# Altium project LCDTest2.PrjPcb
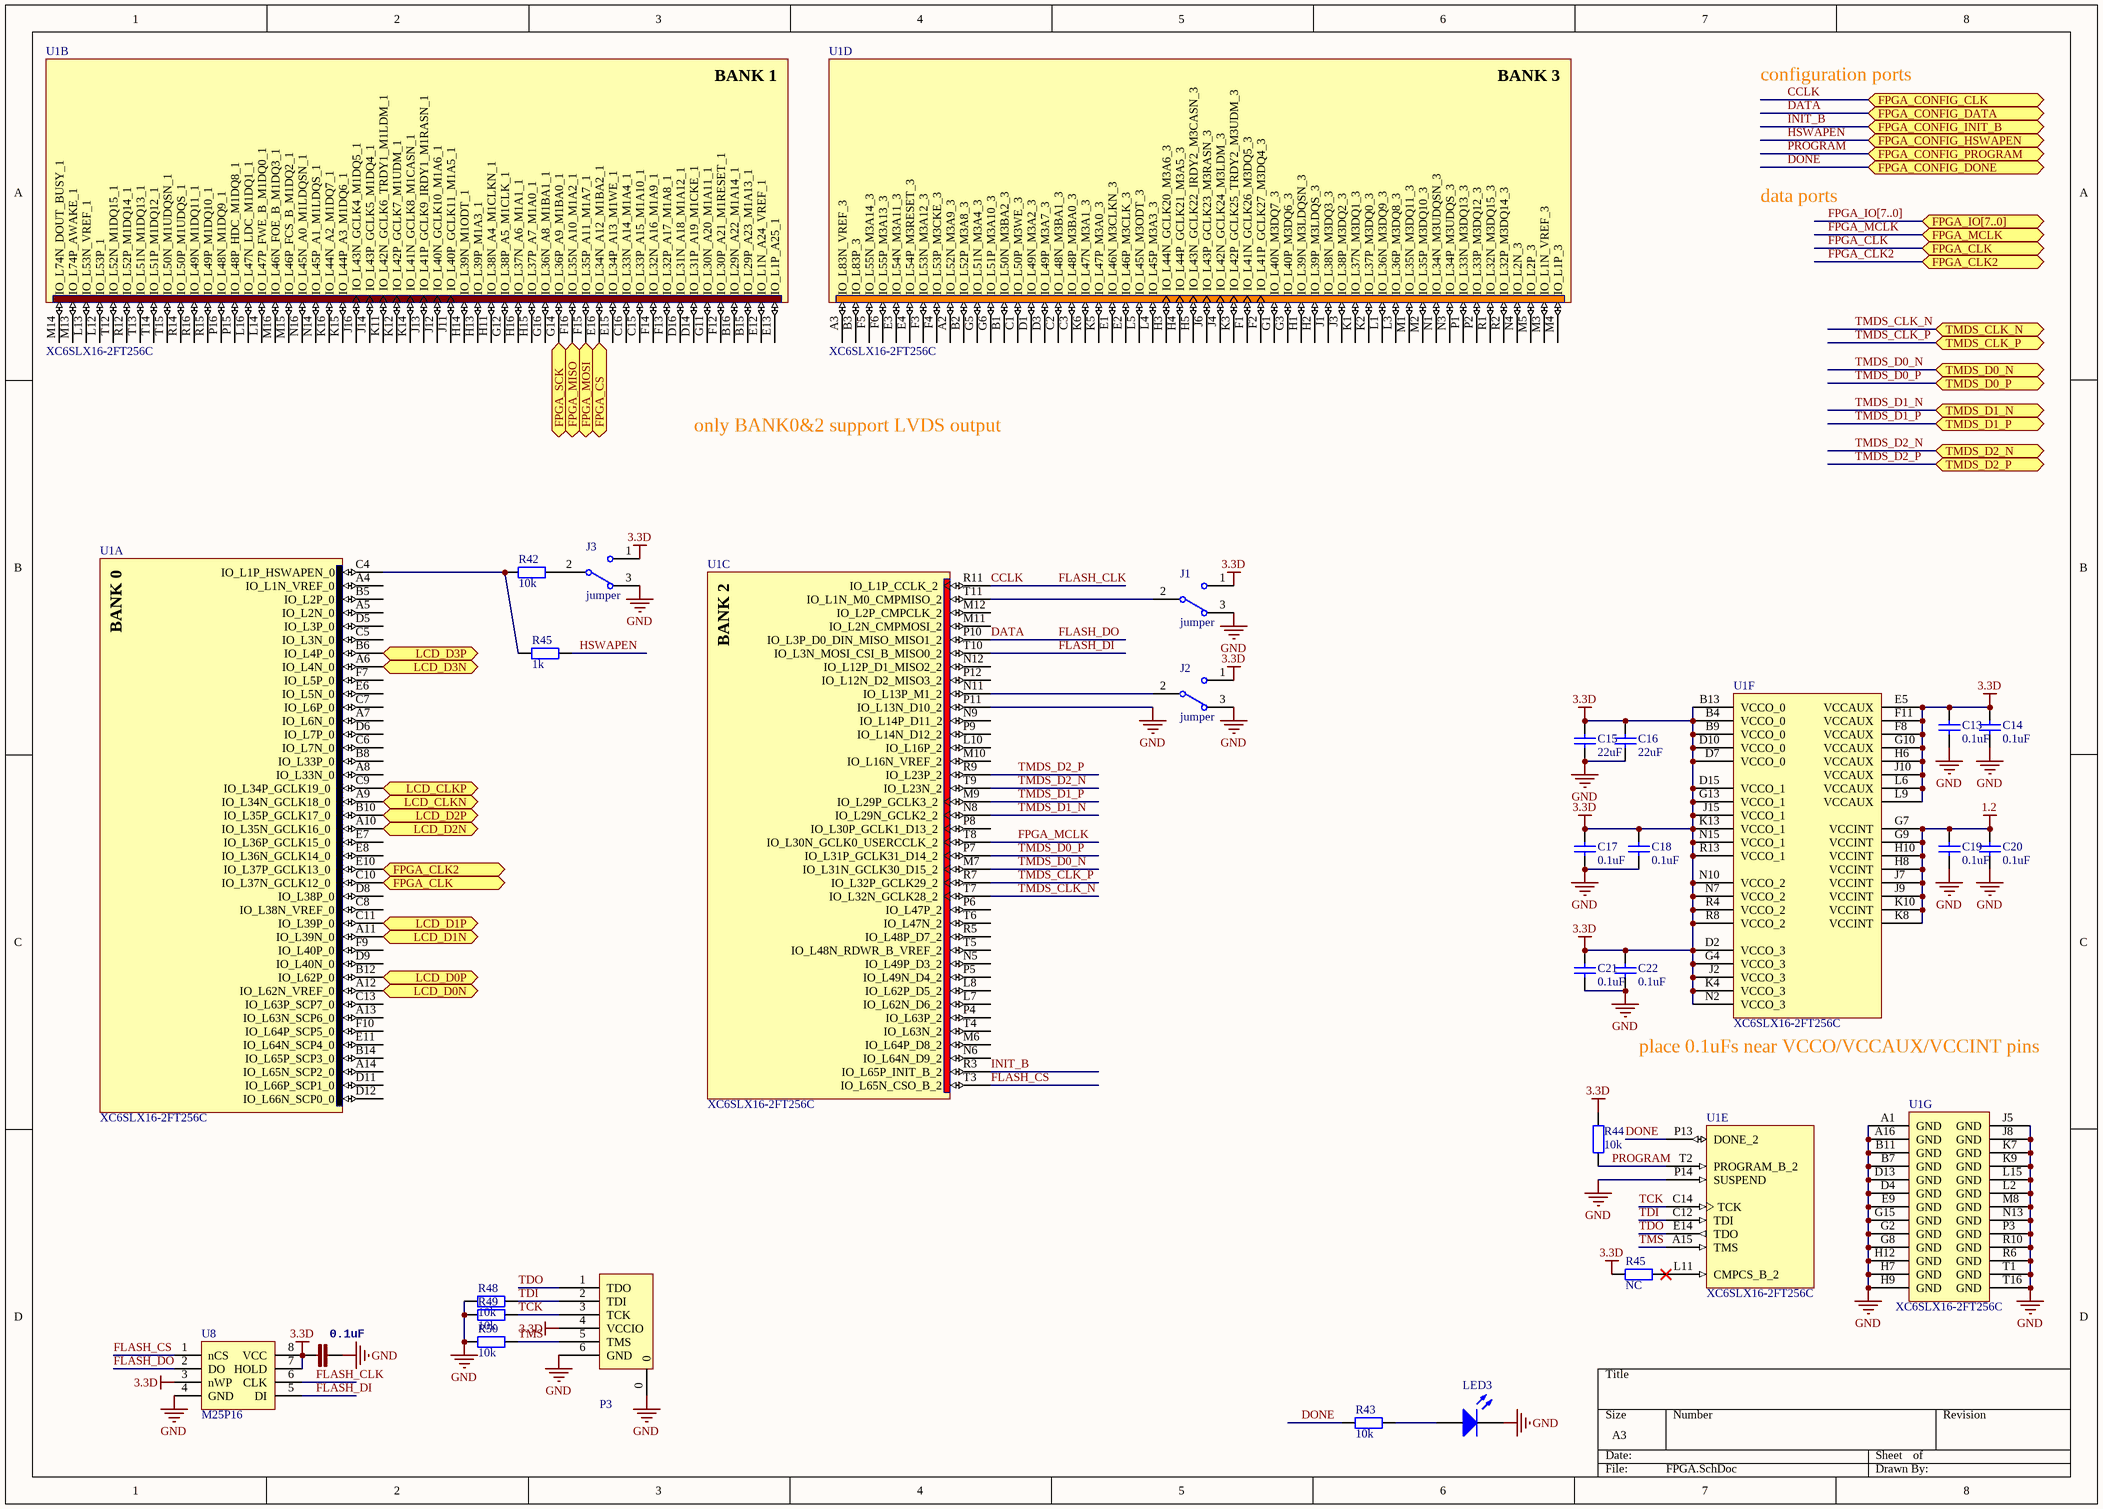
[diagram p0: FPGA.SchDoc]
7 sheets, 154 parts. Net scope: flat (ports and power ports of the same name join across sheets).
Board file: LCDTest2.PcbDoc
Sheets:
  FPGA.SchDoc
  mcu.SchDoc
  camera.SchDoc
  LCD.SchDoc
  USB_HS_PHY.SchDoc
  power.SchDoc
  HDMI.SchDoc

## Sheet FPGA.SchDoc
size A3

### Parts
(Parts that share a designator on the sheet are numbered #1, #2 ... from top to bottom, then left to right.)
C13  0.1uF  [0402]
C14  0.1uF  [0402]
C15  value 22uF  [0805]  (hidden comment: Cap)
C16  value 22uF  [0805]  (hidden comment: Cap)
C17  0.1uF  [0402]
C18  0.1uF  [0402]
C19  0.1uF  [0402]
C20  0.1uF  [0402]
C21  0.1uF  [0402]
C22  0.1uF  [0402]
C68  0.1uF  [0402]
J1  jumper  [0402J]
J2  jumper  [0402J]
J3  jumper  [0402J]
LED3  LED0  [0603]  (value not drawn)
P3  JTAG-6P  [GH1.25-6]  (value not drawn)
R42  10k  [0402]
R43  10k  [0402]
R44  10k  [0402]
R45#1  1k  [0402]
R45#2  NC  [0402]
R48  10k  [0402]
R49  10k  [0402]
R50  10k  [0402]
U1  XC6SLX16-2FT256C  [FT256]  (parts A,B,C,D,E,F,G of 7)
U8  M25P16  [SO8]

### Ports
FPGA_CLK, FPGA_CLK2, FPGA_CONFIG_CLK, FPGA_CONFIG_DATA, FPGA_CONFIG_DONE, FPGA_CONFIG_HSWAPEN, FPGA_CONFIG_INIT_B, FPGA_CONFIG_PROGRAM, FPGA_CS, FPGA_IO[7..0], FPGA_MCLK, FPGA_MISO, FPGA_MOSI, FPGA_SCK, LCD_CLKN, LCD_CLKP, LCD_D0N, LCD_D0P, LCD_D1N, LCD_D1P, LCD_D2N, LCD_D2P, LCD_D3N, LCD_D3P, TMDS_CLK_N, TMDS_CLK_P, TMDS_D0_N, TMDS_D0_P, TMDS_D1_N, TMDS_D1_P, TMDS_D2_N, TMDS_D2_P

### Nets
1.2: C19.1 C20.1 U1.G7(VCCINT) U1.G9(VCCINT) U1.H8(VCCINT) U1.H10(VCCINT) U1.J7(VCCINT) U1.J9(VCCINT) U1.K8(VCCINT) U1.K10(VCCINT)
3.3D: C13.1 C14.1 C15.2 C16.2 C17.1 C18.1 C21.1 C22.1 C68.2 J1.1 J2.1 J3.1 P3.4(VCCIO) R44.1 R45#2.2 U1.B4(VCCO_0) U1.B9(VCCO_0) U1.B13(VCCO_0) U1.D2(VCCO_3) U1.D7(VCCO_0) U1.D10(VCCO_0) U1.D15(VCCO_1) U1.E5(VCCAUX) U1.F8(VCCAUX) U1.F11(VCCAUX) U1.G4(VCCO_3) U1.G10(VCCAUX) U1.G13(VCCO_1) U1.H6(VCCAUX) U1.J2(VCCO_3) U1.J10(VCCAUX) U1.J15(VCCO_1) U1.K4(VCCO_3) U1.K13(VCCO_1) U1.L6(VCCAUX) U1.L9(VCCAUX) U1.N2(VCCO_3) U1.N7(VCCO_2) U1.N10(VCCO_2) U1.N15(VCCO_1) U1.R4(VCCO_2) U1.R8(VCCO_2) U1.R13(VCCO_1) U8.3(nWP) U8.7(HOLD) U8.8(VCC)
GND: C13.2 C14.2 C15.1 C16.1 C17.2 C18.2 C19.2 C20.2 C21.2 C22.2 C68.1 J1.3 J2.3 J3.3 LED3.2(K) P3.0 P3.6(GND) R48.2 R49.2 R50.2 U1.A1(GND) U1.A16(GND) U1.B7(GND) U1.B11(GND) U1.D4(GND) U1.D13(GND) U1.E9(GND) U1.G2(GND) U1.G8(GND) U1.G15(GND) U1.H7(GND) U1.H9(GND) U1.H12(GND) U1.J5(GND) U1.J8(GND) U1.K7(GND) U1.K9(GND) U1.L2(GND) U1.L15(GND) U1.M8(GND) U1.N13(GND) U1.P3(GND) U1.P11(IO_L13N_D10_2) U1.P14(SUSPEND) U1.R6(GND) U1.R10(GND) U1.T1(GND) U1.T16(GND) U8.4(GND)
CCLK: U1.R11(IO_L1P_CCLK_2) U8.6(CLK) ; port FPGA_CONFIG_CLK  [also labelled FLASH_CLK]
CK_N: U1.A9(IO_L34N_GCLK18_0) ; port LCD_CLKN
CK_P: U1.C9(IO_L34P_GCLK19_0) ; port LCD_CLKP
D0_N: U1.A12(IO_L62N_VREF_0) ; port LCD_D0N
D0_P: U1.B12(IO_L62P_0) ; port LCD_D0P
D1_N: U1.A11(IO_L39N_0) ; port LCD_D1N
D1_P: U1.C11(IO_L39P_0) ; port LCD_D1P
D2_N: U1.A10(IO_L35N_GCLK16_0) ; port LCD_D2N
D2_P: U1.B10(IO_L35P_GCLK17_0) ; port LCD_D2P
D3_N: U1.A6(IO_L4N_0) ; port LCD_D3N
D3_P: U1.B6(IO_L4P_0) ; port LCD_D3P
DATA: U1.P10(IO_L3P_D0_DIN_MISO_MISO1_2) U8.2(DO) ; port FPGA_CONFIG_DATA  [also labelled FLASH_DO]
DONE: R43.1 U1.P13(DONE_2) ; port FPGA_CONFIG_DONE
FLASH_CS: U1.T3(IO_L65N_CSO_B_2) U8.1(nCS)
FLASH_DI: U1.T10(IO_L3N_MOSI_CSI_B_MISO0_2) U8.5(DI)
FPGA_CLK: U1.C10(IO_L37N_GCLK12_0) ; port FPGA_CLK
FPGA_CLK2: U1.E10(IO_L37P_GCLK13_0) ; port FPGA_CLK2
FPGA_MCLK: U1.T8(IO_L30N_GCLK0_USERCCLK_2) ; port FPGA_MCLK
HSWAPEN: R45#1.1 ; port FPGA_CONFIG_HSWAPEN
INIT_B: U1.R3(IO_L65P_INIT_B_2) ; port FPGA_CONFIG_INIT_B
PC10: U1.G14(IO_L36P_A9_M1BA0_1) ; port FPGA_SCK
PC11: U1.F16(IO_L35N_A10_M1A2_1) ; port FPGA_MISO
PC12: U1.F15(IO_L35P_A11_M1A7_1) ; port FPGA_MOSI
PROGRAM: R44.2 U1.T2(PROGRAM_B_2) ; port FPGA_CONFIG_PROGRAM
TCK: P3.3(TCK) R49.1 U1.C14(TCK)
TDI: P3.2(TDI) R48.1 U1.C12(TDI)
TDO: P3.1(TDO) U1.E14(TDO)
TMDS_CLK_N: U1.T7(IO_L32N_GCLK28_2) ; port TMDS_CLK_N
TMDS_CLK_P: U1.R7(IO_L32P_GCLK29_2) ; port TMDS_CLK_P
TMDS_D0_N: U1.M7(IO_L31N_GCLK30_D15_2) ; port TMDS_D0_N
TMDS_D0_P: U1.P7(IO_L31P_GCLK31_D14_2) ; port TMDS_D0_P
TMDS_D1_N: U1.N8(IO_L29N_GCLK2_2) ; port TMDS_D1_N
TMDS_D1_P: U1.M9(IO_L29P_GCLK3_2) ; port TMDS_D1_P
TMDS_D2_N: U1.T9(IO_L23N_2) ; port TMDS_D2_N
TMDS_D2_P: U1.R9(IO_L23P_2) ; port TMDS_D2_P
TMS: P3.5(TMS) R50.1 U1.A15(TMS)
NetJ1_2: J1.2 U1.T11(IO_L1N_M0_CMPMISO_2)
NetJ2_2: J2.2 U1.N11(IO_L13P_M1_2)
NetJ3_2: J3.2 R42.1
NetLED3_1: LED3.1(A) R43.2
NetMCU1_2: U1.E16(IO_L34N_A12_M1BA2_1) ; port FPGA_CS
NetR42_2: R42.2 R45#1.2 U1.C4(IO_L1P_HSWAPEN_0)
NetR45#2_1: R45#2.1 U1.L11(CMPCS_B_2)

Not connected (* = marked no-connect by the designer): U1 A2(IO_L52N_M3A9_3) A3(IO_L83N_VREF_3) A4(IO_L1N_VREF_0) A5(IO_L2N_0) A7(IO_L6N_0) A8(IO_L33N_0) A13(IO_L63N_SCP6_0) A14(IO_L65N_SCP2_0) B1(IO_L50N_M3BA2_3) B2(IO_L52P_M3A8_3) B3(IO_L83P_3) B5(IO_L2P_0) B8(IO_L33P_0) B14(IO_L65P_SCP3_0) B15(IO_L29P_A23_M1A13_1) B16(IO_L29N_A22_M1A14_1) C1(IO_L50P_M3WE_3) C2(IO_L48N_M3BA1_3) C3(IO_L48P_M3BA0_3) C5(IO_L3N_0) C6(IO_L7N_0) C7(IO_L6P_0) C8(IO_L38N_VREF_0) C13(IO_L63P_SCP7_0) C15(IO_L33P_A15_M1A10_1) C16(IO_L33N_A14_M1A4_1) D1(IO_L49N_M3A2_3) D3(IO_L49P_M3A7_3) D5(IO_L3P_0) D6(IO_L7P_0) D8(IO_L38P_0) D9(IO_L40N_0) D11(IO_L66P_SCP1_0) D12(IO_L66N_SCP0_0) D14(IO_L31P_A19_M1CKE_1) D16(IO_L31N_A18_M1A12_1) E1(IO_L46N_M3CLKN_3) E2(IO_L46P_M3CLK_3) E3(IO_L54N_M3A11_3) E4(IO_L54P_M3RESET_3) E6(IO_L5N_0) E7(IO_L36P_GCLK15_0) E8(IO_L36N_GCLK14_0) E11(IO_L64N_SCP4_0) E12(IO_L1N_A24_VREF_1) E13(IO_L1P_A25_1) E15(IO_L34P_A13_M1WE_1) F1(IO_L41N_GCLK26_M3DQ5_3) F2(IO_L41P_GCLK27_M3DQ4_3) F3(IO_L53N_M3A12_3) F4(IO_L53P_M3CKE_3) F5(IO_L55N_M3A14_3) F6(IO_L55P_M3A13_3) F7(IO_L5P_0) F9(IO_L40P_0) F10(IO_L64P_SCP5_0) F12(IO_L30P_A21_M1RESET_1) F13(IO_L32P_A17_M1A8_1) F14(IO_L32N_A16_M1A9_1) G1(IO_L40N_M3DQ7_3) G3(IO_L40P_M3DQ6_3) G5(IO_L51N_M3A4_3) G6(IO_L51P_M3A10_3) G11(IO_L30N_A20_M1A11_1) G12(IO_L38P_A5_M1CLK_1) G16(IO_L36N_A8_M1BA1_1) H1(IO_L39N_M3LDQSN_3) H2(IO_L39P_M3LDQS_3) H3(IO_L44N_GCLK20_M3A6_3) H4(IO_L44P_GCLK21_M3A5_3) H5(IO_L43N_GCLK22_IRDY2_M3CASN_3) H11(IO_L38N_A4_M1CLKN_1) H13(IO_L39P_M1A3_1) H14(IO_L39N_M1ODT_1) H15(IO_L37P_A7_M1A0_1) H16(IO_L37N_A6_M1A1_1) J1(IO_L38N_M3DQ3_3) J3(IO_L38P_M3DQ2_3) J4(IO_L42N_GCLK24_M3LDM_3) J6(IO_L43P_GCLK23_M3RASN_3) J11(IO_L40P_GCLK11_M1A5_1) J12(IO_L40N_GCLK10_M1A6_1) J13(IO_L41P_GCLK9_IRDY1_M1RASN_1) J14(IO_L43P_GCLK5_M1DQ4_1) J16(IO_L43N_GCLK4_M1DQ5_1) K1(IO_L37N_M3DQ1_3) K2(IO_L37P_M3DQ0_3) K3(IO_L42P_GCLK25_TRDY2_M3UDM_3) K5(IO_L47P_M3A0_3) K6(IO_L47N_M3A1_3) K11(IO_L42N_GCLK6_TRDY1_M1LDM_1) K12(IO_L42P_GCLK7_M1UDM_1) K14(IO_L41N_GCLK8_M1CASN_1) K15(IO_L44P_A3_M1DQ6_1) K16(IO_L44N_A2_M1DQ7_1) L1(IO_L36N_M3DQ9_3) L3(IO_L36P_M3DQ8_3) L4(IO_L45P_M3A3_3) L5(IO_L45N_M3ODT_3) L7(IO_L62N_D6_2) L8(IO_L62P_D5_2) L10(IO_L16P_2) L12(IO_L53P_1) L13(IO_L53N_VREF_1) L14(IO_L47P_FWE_B_M1DQ0_1) L16(IO_L47N_LDC_M1DQ1_1) M1(IO_L35N_M3DQ11_3) M2(IO_L35P_M3DQ10_3) M3(IO_L1N_VREF_3) M4(IO_L1P_3) M5(IO_L2P_3) M6(IO_L64P_D8_2) M10(IO_L16N_VREF_2) M11(IO_L2N_CMPMOSI_2) M12(IO_L2P_CMPCLK_2) M13(IO_L74P_AWAKE_1) M14(IO_L74N_DOUT_BUSY_1) M15(IO_L46P_FCS_B_M1DQ2_1) M16(IO_L46N_FOE_B_M1DQ3_1) N1(IO_L34N_M3UDQSN_3) N3(IO_L34P_M3UDQS_3) N4(IO_L2N_3) N5(IO_L49P_D3_2) N6(IO_L64N_D9_2) N9(IO_L14P_D11_2) N12(IO_L12P_D1_MISO2_2) N14(IO_L45P_A1_M1LDQS_1) N16(IO_L45N_A0_M1LDQSN_1) P1(IO_L33N_M3DQ13_3) P2(IO_L33P_M3DQ12_3) P4(IO_L63P_2) P5(IO_L49N_D4_2) P6(IO_L47P_2) P8(IO_L30P_GCLK1_D13_2) P9(IO_L14N_D12_2) P12(IO_L12N_D2_MISO3_2) P15(IO_L48P_HDC_M1DQ8_1) P16(IO_L48N_M1DQ9_1) R1(IO_L32N_M3DQ15_3) R2(IO_L32P_M3DQ14_3) R5(IO_L48P_D7_2) R12(IO_L52P_M1DQ14_1) R14(IO_L50P_M1UDQS_1) R15(IO_L49P_M1DQ10_1) R16(IO_L49N_M1DQ11_1) T4(IO_L63N_2) T5(IO_L48N_RDWR_B_VREF_2) T6(IO_L47N_2) T12(IO_L52N_M1DQ15_1) T13(IO_L51N_M1DQ13_1) T14(IO_L51P_M1DQ12_1) T15(IO_L50N_M1UDQSN_1)

### Buses and harness runs
bus FPGA_IO[7..0] = port FPGA_IO[7..0]

### Notes on the sheet
- configuration ports
- data ports
- only BANK0&2 support LVDS output
- (near U1) place 0.1uFs near VCCO/VCCAUX/VCCINT pins
- (in symbol XC6SLX16-2FT256C, part A) BANK 0
- (in symbol XC6SLX16-2FT256C, part B) BANK 1
- (in symbol XC6SLX16-2FT256C, part C) BANK 2
- (in symbol XC6SLX16-2FT256C, part D) BANK 3

### Library data of the parts
C13-C22 = Cap: Capacitor; Published: 8-Jun-2000; LatestRevisionDate: 17-Jul-2002; LatestRevisionNote: Re-released for DXP Platform.; PackageReference: RAD-0.3; Publisher: Altium Limited; PackageDescription: Radial Cap, Thru-Hole; 2 Leads; 0.3 in Pin Spacing
C68 = CAP0402-CAP: <b>Capacitor</b> / Standard 0603 ceramic capacitor, and 0.1" leaded capacitor.; PARTNO: CC0402ZRY5V7BB104
J1-J3 = SW-SPDT: SPDT Subminiature Toggle Switch, Right Angle Mounting, Vertical Actuation; Published: 24-Mar-1999; LatestRevisionDate: 17-Dec-2003; LatestRevisionNote: Schematic revised, PCB Footprint replaced.; DatasheetVersion: 05-Dec-2000; PackageReference: TL36WW15050; Publisher: Altium Limited; PackageDescription: Switch; 4 Leads; ComponentLink1Description: Manufacturer Link; ComponentLink1URL: http://www.apem.com
LED3 = LED0: Typical INFRARED GaAs LED; Published: 8-Jun-2000; LatestRevisionDate: 08-Jul-2005; LatestRevisionNote: Mech Layer 1 removed.; PackageReference: LED-0; Publisher: Altium Limited; PackageDescription: LED; 2 Leads
R42-R44 R45#1 R45#2 R48-R50 = Res2: Resistor; Published: 8-Jun-2000; LatestRevisionDate: 17-Jul-2002; LatestRevisionNote: Re-released for DXP Platform.; PackageReference: AXIAL-0.4; Publisher: Altium Limited; PackageDescription: Axial Device, Thru-Hole; 2 Leads; 0.4 in Pin Spacing
U1 = XC6SLX16-2FT256C: Spartan-6 LX 1.2V FPGA, 186 User I/Os, 256-Ball Fine-Pitch Thin BGA (1.0mm Pitch), Speed Grade 2, Commercial Grade; Published: 17-Nov-2009; DatasheetVersion: ver1.6, Nov-2010; PackageVersion: ver1.3, Oct-2007; PackageReference: FT256; Publisher: Altium Limited; PackageDescription: 256-Ball Fine Pitch Thin Ball Grid Array 1.00 mm Pitch (FT256); Code_JEDEC: MS-034-AAF-1*; ComponentLink1Description: Manufacturer Link; ComponentLink1URL: http://www.xilinx.com; ComponentLink2Description: Spartan-6 Datasheet; ComponentLink2URL: http://www.xilinx.com/support/documentation/data_sheets/ds160.pdf; ComponentLink3Description: Spartan-6 Documents; ComponentLink3URL: http://www.xilinx.com/support/documentation/spartan-6.htm; ComponentLink4Description: Xilinx.com Home; ComponentLink4URL: http://www.xilinx.com

## Sheet mcu.SchDoc
size A4
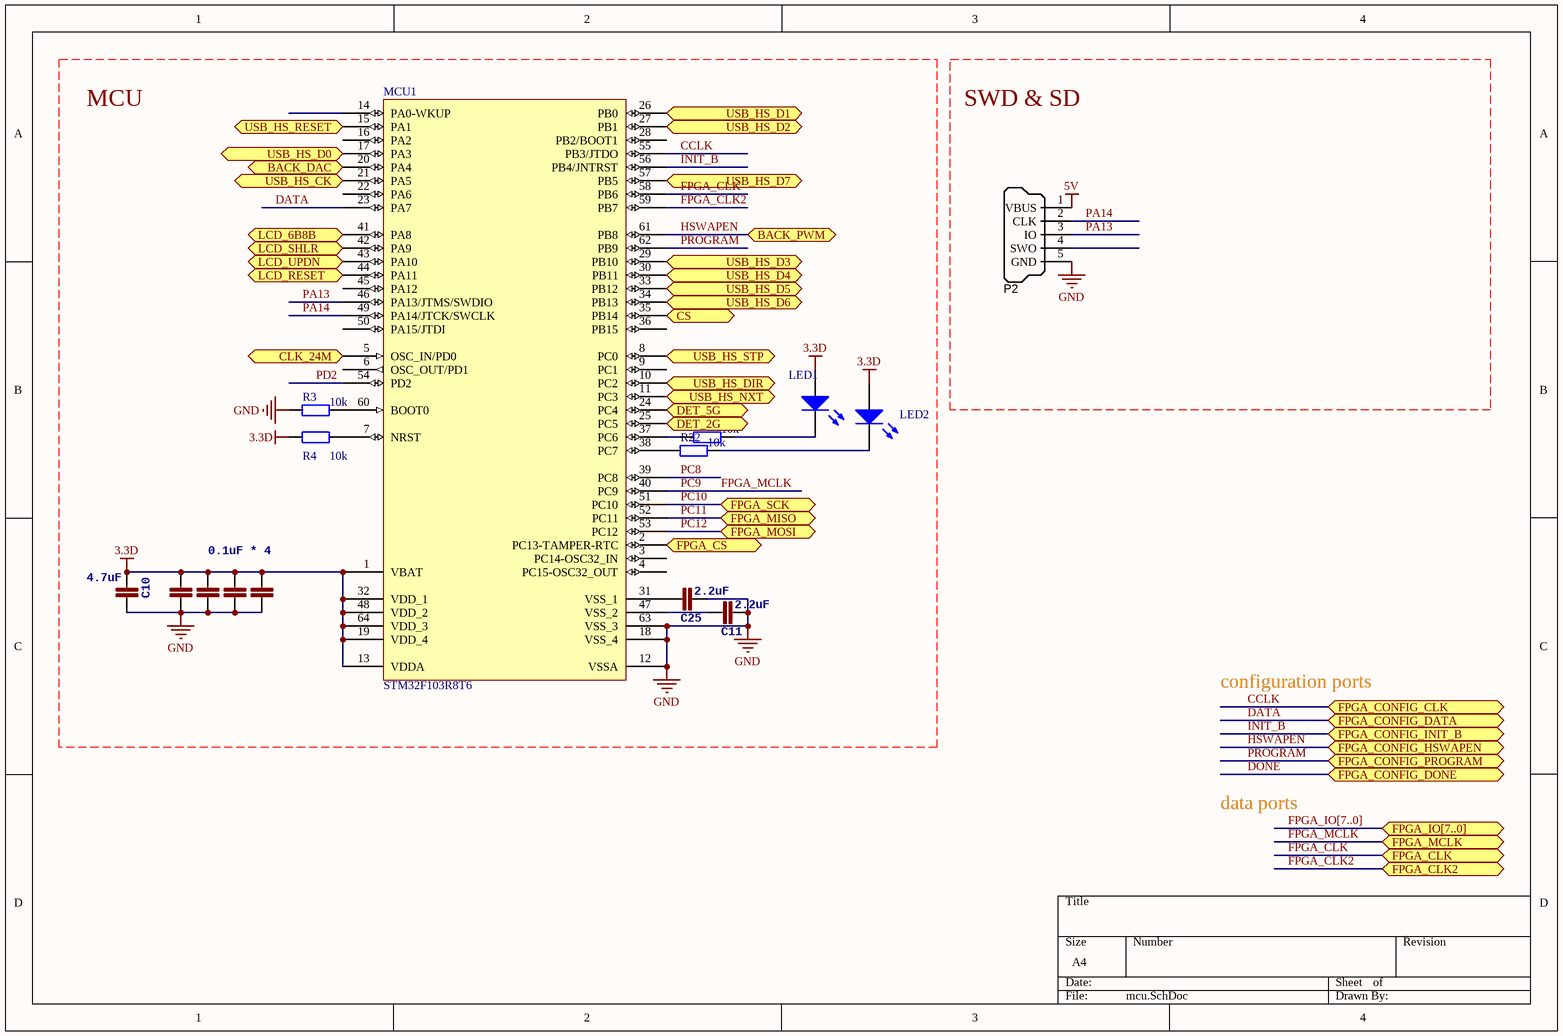
[diagram p1: mcu.SchDoc]

### Parts
C4  0.1uF * 4  [0402]
C5  1n  [0402]  (value not drawn)
C6  1n  [0402]  (value not drawn)
C7  1n  [0402]  (value not drawn)
C10  4.7uF  [0603]
C11  2.2uF  [0603]
C25  2.2uF  [0603]
LED1  LED0  [0603]  (value not drawn)
LED2  LED0  [0603]  (value not drawn)
MCU1  STM32F103R8T6  [LQFP64_N]
P2  SWD_MicroUSB  [MICRO-YZX]  (value not drawn)
R3  10k  [0402]
R4  10k  [0402]
R21  10k  [0402]
R22  10k  [0402]

### Ports
BACK_DAC, BACK_PWM, CLK_24M, CS, DET_2G, DET_5G, FPGA_CLK, FPGA_CLK2, FPGA_CONFIG_CLK, FPGA_CONFIG_DATA, FPGA_CONFIG_DONE, FPGA_CONFIG_HSWAPEN, FPGA_CONFIG_INIT_B, FPGA_CONFIG_PROGRAM, FPGA_CS, FPGA_IO[7..0], FPGA_MCLK, FPGA_MISO, FPGA_MOSI, FPGA_SCK, LCD_6B8B, LCD_RESET, LCD_SHLR, LCD_UPDN, USB_HS_CK, USB_HS_D0, USB_HS_D1, USB_HS_D2, USB_HS_D3, USB_HS_D4, USB_HS_D5, USB_HS_D6, USB_HS_D7, USB_HS_DIR, USB_HS_NXT, USB_HS_RESET, USB_HS_STP

### Nets
3.3D: C4.2 C5.2 C6.2 C7.2 C10.2 LED1.1(A) LED2.1(A) MCU1.1(VBAT) MCU1.13(VDDA) MCU1.19(VDD_4) MCU1.32(VDD_1) MCU1.48(VDD_2) MCU1.64(VDD_3) R4.2
5V: P2.1(VBUS)
GND: C4.1 C5.1 C6.1 C7.1 C10.1 C11.2 C25.2 MCU1.12(VSSA) MCU1.18(VSS_4) MCU1.63(VSS_3) P2.5(GND) R3.1
CCLK: MCU1.55(PB3/JTDO) ; port FPGA_CONFIG_CLK
DATA: MCU1.23(PA7) ; port FPGA_CONFIG_DATA
FPGA_CLK: MCU1.58(PB6) ; port FPGA_CLK
FPGA_CLK2: MCU1.59(PB7) ; port FPGA_CLK2
FPGA_MCLK: MCU1.40(PC9) ; port FPGA_MCLK  [also labelled PC9]
HSWAPEN: MCU1.61(PB8) ; port FPGA_CONFIG_HSWAPEN, port BACK_PWM
INIT_B: MCU1.56(PB4/JNTRST) ; port FPGA_CONFIG_INIT_B
PA13: MCU1.46(PA13/JTMS/SWDIO) P2.3(IO)
PA14: MCU1.49(PA14/JTCK/SWCLK) P2.2(CLK)
PC8: MCU1.39(PC8)
PC10: MCU1.51(PC10) ; port FPGA_SCK
PC11: MCU1.52(PC11) ; port FPGA_MISO
PC12: MCU1.53(PC12) ; port FPGA_MOSI
PD2: MCU1.54(PD2)
PROGRAM: MCU1.62(PB9) ; port FPGA_CONFIG_PROGRAM
USB_HS_CK: MCU1.21(PA5) ; port USB_HS_CK
USB_HS_DIR: MCU1.10(PC2) ; port USB_HS_DIR
USB_HS_NXT: MCU1.11(PC3) ; port USB_HS_NXT
USB_HS_RESET: MCU1.15(PA1) ; port USB_HS_RESET
USB_HS_STP: MCU1.8(PC0) ; port USB_HS_STP
NetC11_1: C11.1 MCU1.47(VSS_2)
NetC25_1: C25.1 MCU1.31(VSS_1)
NetC108_2: MCU1.5(OSC_IN/PD0) ; port CLK_24M
NetLED1_2: LED1.2(K) R21.2
NetLED2_2: LED2.2(K) R22.2
NetMCU1_2: MCU1.2(PC13-TAMPER-RTC) ; port FPGA_CS
NetMCU1_7: MCU1.7(NRST) R4.1
NetMCU1_17: MCU1.17(PA3) ; port USB_HS_D0
NetMCU1_20: MCU1.20(PA4) ; port BACK_DAC
NetMCU1_24: MCU1.24(PC4) ; port DET_5G
NetMCU1_25: MCU1.25(PC5) ; port DET_2G
NetMCU1_26: MCU1.26(PB0) ; port USB_HS_D1
NetMCU1_27: MCU1.27(PB1) ; port USB_HS_D2
NetMCU1_29: MCU1.29(PB10) ; port USB_HS_D3
NetMCU1_30: MCU1.30(PB11) ; port USB_HS_D4
NetMCU1_33: MCU1.33(PB12) ; port USB_HS_D5
NetMCU1_34: MCU1.34(PB13) ; port USB_HS_D6
NetMCU1_35: MCU1.35(PB14) ; port CS
NetMCU1_37: MCU1.37(PC6) R21.1
NetMCU1_38: MCU1.38(PC7) R22.1
NetMCU1_41: MCU1.41(PA8) ; port LCD_6B8B
NetMCU1_42: MCU1.42(PA9) ; port LCD_SHLR
NetMCU1_43: MCU1.43(PA10) ; port LCD_UPDN
NetMCU1_44: MCU1.44(PA11) ; port LCD_RESET
NetMCU1_57: MCU1.57(PB5) ; port USB_HS_D7
NetMCU1_60: MCU1.60(BOOT0) R3.2

Not connected (* = marked no-connect by the designer): MCU1 3(PC14-OSC32_IN) 4(PC15-OSC32_OUT) 6(OSC_OUT/PD1) 9(PC1) 14(PA0-WKUP) 16(PA2) 22(PA6) 28(PB2/BOOT1) 36(PB15) 45(PA12) 50(PA15/JTDI); P2 4(SWO)

### Buses and harness runs
bus FPGA_IO[7..0] = port FPGA_IO[7..0]

### Notes on the sheet
- MCU
- SWD & SD
- configuration ports
- data ports

### Library data of the parts
C4-C7 C10 C11 C25 = CAP0402-CAP: as C68 on sheet FPGA
LED1 LED2 = LED0: Typical INFRARED GaAs LED; Published: 8-Jun-2000; LatestRevisionDate: 08-Jul-2005; LatestRevisionNote: Mech Layer 1 removed.; PackageReference: LED-0; Publisher: Altium Limited; PackageDescription: LED; 2 Leads
MCU1 = STM32F103R8T6: STM32 ARM-based 32-bit MCU with 64 Kbytes Flash, 64-pin LQFP, Industrial Temperature; Published: *; DatasheetVersion: *; PackageVersion: *; PackageReference: *; Publisher: *; PackageDescription: *; ComponentLink1Description: *; ComponentLink1URL: *; ComponentLink2Description: *; ComponentLink2URL: *
P2 = SWD_MicroUSB: Connector SMD USB Micro Type B middle mount; Manufacturer 1: Molex Inc; SCDType: undef; Package / Case: SMD; Supplier 1: Digi-Key; Supplier Part Number 1: WM17142CT-ND
R3 R4 R21 R22 = Res2: Resistor; Value: 0Ohm; Published: 8-Jun-2000; LatestRevisionDate: 17-Jul-2002; LatestRevisionNote: Re-released for DXP Platform.; PackageReference: AXIAL-0.4; Publisher: Altium Limited; PackageDescription: Axial Device, Thru-Hole; 2 Leads; 0.4 in Pin Spacing

## Sheet camera.SchDoc
size A4
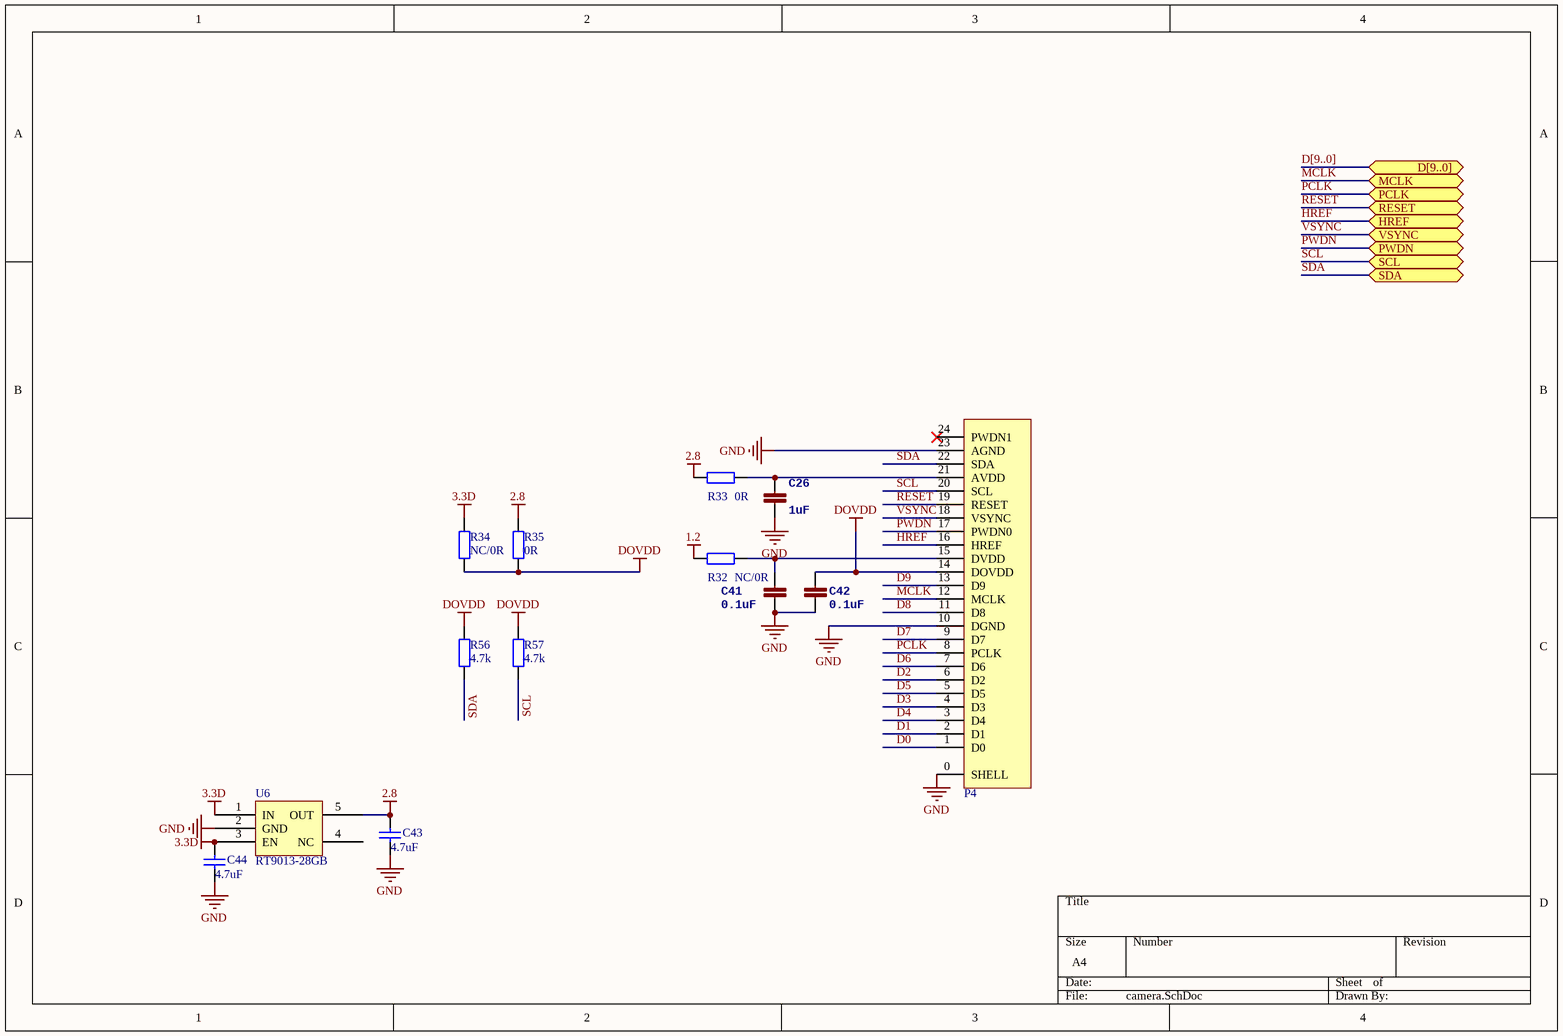
[diagram p2: camera.SchDoc]

### Parts
C26  1uF  [0402]
C41  0.1uF  [0402]
C42  0.1uF  [0402]
C43  4.7uF  [0603]
C44  4.7uF  [0603]
P4  Camera24P-2  [FPC-0.5mm-24]  (value not drawn)
R32  NC/0R  [0402]
R33  0R  [0402]
R34  NC/0R  [0402]
R35  0R  [0402]
R56  4.7k  [0402]
R57  4.7k  [0402]
U6  RT9013-28GB  [SOT23-5]

### Ports
D[9..0], HREF, MCLK, PCLK, PWDN, RESET, SCL, SDA, VSYNC

### Nets
1.2: R32.2
2.8: C43.2 R33.2 R35.1 U6.5(OUT)
3.3D: C44.2 R34.1 U6.1(IN) U6.3(EN)
DOVDD: C42.2 P4.14(DOVDD) R34.2 R35.2 R56.1 R57.1
GND: C26.1 C41.1 C42.1 C43.1 C44.1 P4.0(SHELL) P4.10(DGND) P4.23(AGND) U6.2(GND)
D0: P4.1(D0)
D1: P4.2(D1)
D2: P4.6(D2)
D3: P4.4(D3)
D4: P4.3(D4)
D5: P4.5(D5)
D6: P4.7(D6)
D7: P4.9(D7)
D8: P4.11(D8)
D9: P4.13(D9)
HREF: P4.16(HREF) ; port HREF
MCLK: P4.12(MCLK) ; port MCLK
PCLK: P4.8(PCLK) ; port PCLK
PWDN: P4.17(PWDN0) ; port PWDN
RESET: P4.19(RESET) ; port RESET
SCL: P4.20(SCL) R57.2 ; port SCL
SDA: P4.22(SDA) R56.2 ; port SDA
VSYNC: P4.18(VSYNC) ; port VSYNC
NetC26_2: C26.2 P4.21(AVDD) R33.1
NetC41_2: C41.2 P4.15(DVDD) R32.1

Not connected (* = marked no-connect by the designer): P4 24(PWDN1)*; U6 4(NC)

### Buses and harness runs
bus D[9..0] = port D[9..0]

### Library data of the parts
C26 C41 C42 = CAP0402-CAP: as C68 on sheet FPGA
C43 C44 = Cap: Capacitor; Published: 8-Jun-2000; LatestRevisionDate: 17-Jul-2002; LatestRevisionNote: Re-released for DXP Platform.; PackageReference: RAD-0.3; Publisher: Altium Limited; PackageDescription: Radial Cap, Thru-Hole; 2 Leads; 0.3 in Pin Spacing
R32-R35 R56 R57 = Res2: Resistor; Value: 0Ohm; Published: 8-Jun-2000; LatestRevisionDate: 17-Jul-2002; LatestRevisionNote: Re-released for DXP Platform.; PackageReference: AXIAL-0.4; Publisher: Altium Limited; PackageDescription: Axial Device, Thru-Hole; 2 Leads; 0.4 in Pin Spacing
U6 = LP5907

## Sheet LCD.SchDoc
size A4
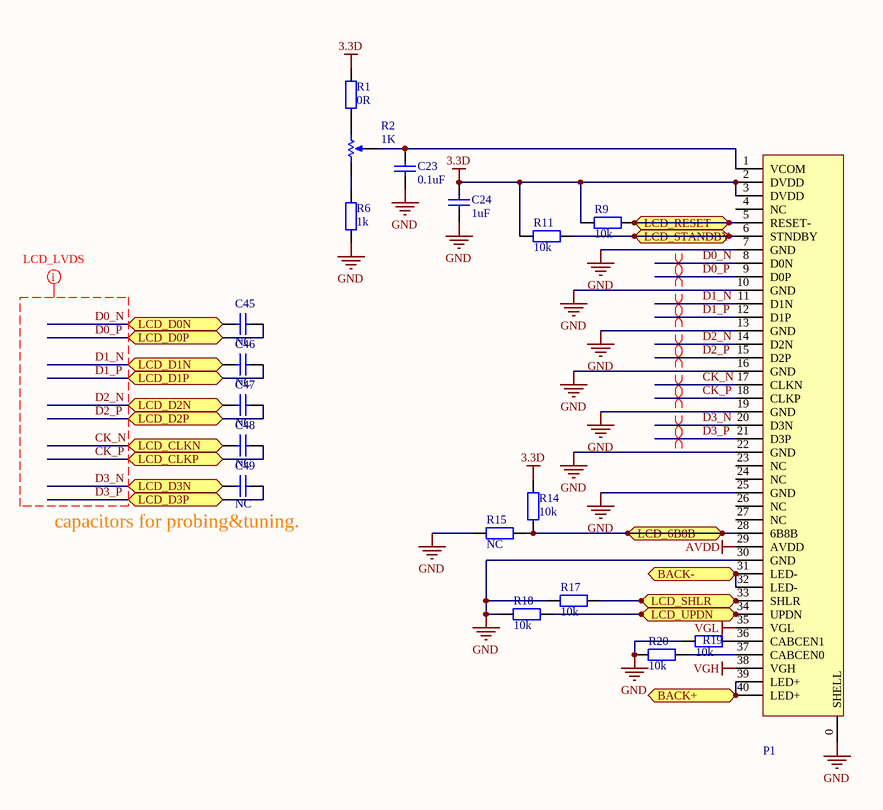
[diagram p3: LCD.SchDoc]

### Parts
C23  0.1uF  [0402]
C24  1uF  [0402]
C45  NC  [0402]
C46  NC  [0402]
C47  NC  [0402]
C48  NC  [0402]
C49  NC  [0402]
P1  LCD_40P_LVDS  [FPC-0.5mm-40]  (value not drawn)
R1  0R  [0402]
R2  value 1K  [POT1]  (hidden comment: RPot)
R6  1k  [0402]
R9  10k  [0402]
R11  10k  [0402]
R14  10k  [0402]
R15  NC  [0402]
R17  10k  [0402]
R18  10k  [0402]
R19  10k  [0402]
R20  10k  [0402]

### Ports
BACK+, BACK-, LCD_6B8B, LCD_CLKN, LCD_CLKP, LCD_D0N, LCD_D0P, LCD_D1N, LCD_D1P, LCD_D2N, LCD_D2P, LCD_D3N, LCD_D3P, LCD_RESET, LCD_SHLR, LCD_STANDBY, LCD_UPDN

### Nets
3.3D: C24.1 P1.2(DVDD) P1.3(DVDD) R1.2 R9.1 R11.1 R14.2
AVDD: P1.29(AVDD)
GND: C23.2 C24.2 P1.0(SHELL) P1.7(GND) P1.10(GND) P1.13(GND) P1.16(GND) P1.19(GND) P1.22(GND) P1.25(GND) P1.30(GND) R6.1 R15.1 R17.1 R18.1 R19.1 R20.1
VGH: P1.38(VGH)
VGL: P1.35(VGL)
CK_N: C48.1 P1.17(CLKN) ; port LCD_CLKN
CK_P: C48.2 P1.18(CLKP) ; port LCD_CLKP
D0_N: C45.1 P1.8(D0N) ; port LCD_D0N
D0_P: C45.2 P1.9(D0P) ; port LCD_D0P
D1_N: C46.1 P1.11(D1N) ; port LCD_D1N
D1_P: C46.2 P1.12(D1P) ; port LCD_D1P
D2_N: C47.1 P1.14(D2N) ; port LCD_D2N
D2_P: C47.2 P1.15(D2P) ; port LCD_D2P
D3_N: C49.1 P1.20(D3N) ; port LCD_D3N
D3_P: C49.2 P1.21(D3P) ; port LCD_D3P
NetC23_1: C23.1 P1.1(VCOM) R2.3(TAP)
NetC51_2: P1.39(LED+) P1.40(LED+) ; port BACK+
NetMCU1_41: P1.28(6B8B) R14.1 R15.2 ; port LCD_6B8B
NetMCU1_42: P1.33(SHLR) R17.2 ; port LCD_SHLR
NetMCU1_43: P1.34(UPDN) R18.2 ; port LCD_UPDN
NetMCU1_44: P1.5(RESET-) R9.2 ; port LCD_RESET
NetP1_6: P1.6(STNDBY) R11.2 ; port LCD_STANDBY
NetP1_31: P1.31(LED-) P1.32(LED-) ; port BACK-
NetP1_36: P1.36(CABCEN1) R19.2
NetP1_37: P1.37(CABCEN0) R20.2
NetR1_1: R1.1 R2.2(BOT)
NetR2_1: R2.1(TOP) R6.2

Not connected (* = marked no-connect by the designer): P1 4(NC) 23(NC) 24(NC) 26(NC) 27(NC)

### Layout directives
differential pair: CK_N, CK_P, D0_N, D0_P, D1_N, D1_P, D2_N, D2_P, D3_N, D3_P
net class LCD_LVDS: CK_N, CK_P, D0_N, D0_P, D1_N, D1_P, D2_N, D2_P, D3_N, D3_P

### Notes on the sheet
- (near C49) capacitors for probing&tuning.

### Library data of the parts
C23 C24 C45-C49 = Cap: Capacitor; Published: 8-Jun-2000; LatestRevisionDate: 17-Jul-2002; LatestRevisionNote: Re-released for DXP Platform.; PackageReference: RAD-0.3; Publisher: Altium Limited; PackageDescription: Radial Cap, Thru-Hole; 2 Leads; 0.3 in Pin Spacing
R1 R6 R9 R11 R14 R15 R17-R20 = Res2: Resistor; Published: 8-Jun-2000; LatestRevisionDate: 17-Jul-2002; LatestRevisionNote: Re-released for DXP Platform.; PackageReference: AXIAL-0.4; Publisher: Altium Limited; PackageDescription: Axial Device, Thru-Hole; 2 Leads; 0.4 in Pin Spacing
R2 = RPot: Potentiometer; Sim Note: Enter the Resistance value and the set point into parameter fields.; Set Position: 0.5; Published: 8-Jun-2000; LatestRevisionDate: 17-Jul-2002; LatestRevisionNote: Re-released for DXP Platform.; PackageReference: VR5; Publisher: Altium Limited; PackageDescription: Variable Resistor, Thru-Hole; 3 Leads

## Sheet USB_HS_PHY.SchDoc
size A4
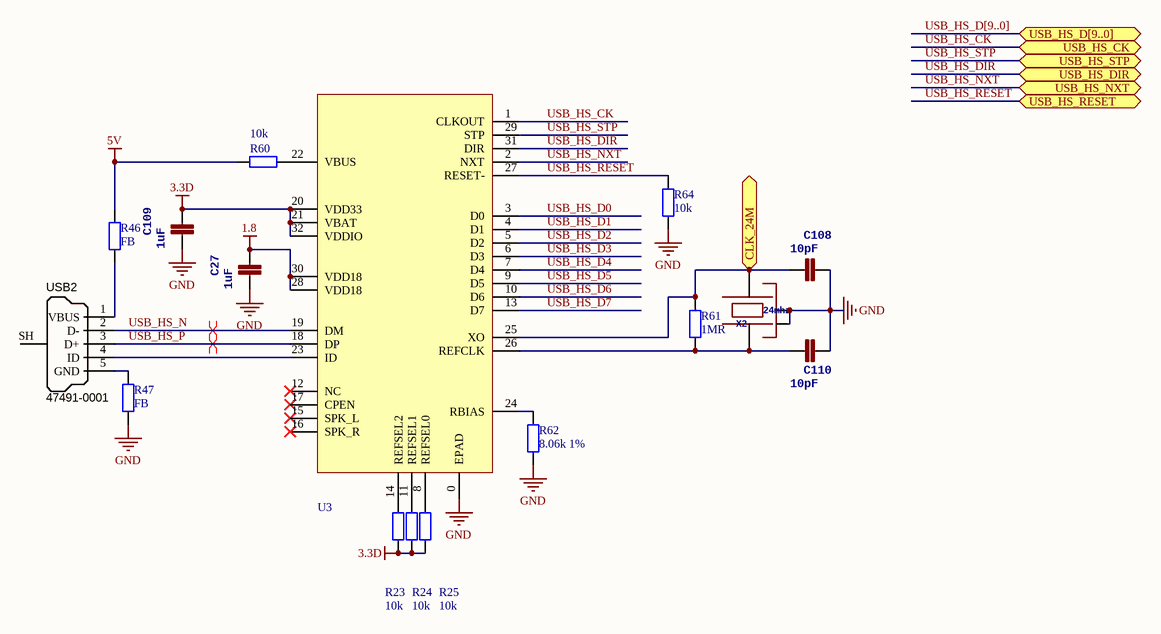
[diagram p4: USB_HS_PHY.SchDoc]

### Parts
C27  1uF  [0402]
C108  10pF  [0402]
C109  1uF  [0402]
C110  10pF  [0402]
R23  10k  [0402]
R24  10k  [0402]
R25  10k  [0402]
R46  FB  [0603]
R47  FB  [0603]
R60  10k  [0402]
R61  1MR  [0402]
R62  8.06k 1%  [0402]
R64  10k  [0402]
U3  USB3320  [USB3300]  (value not drawn)
USB2  Manufacturer Part Number 1: 47491-0001  [MICRO-YZX]  (hidden comment: USB Micro Type B)
X2  24mhz  [OSCILLATOR-3.2X2.5]

### Ports
CLK_24M, USB_HS_CK, USB_HS_D[9..0], USB_HS_DIR, USB_HS_NXT, USB_HS_RESET, USB_HS_STP

### Nets
1.8: C27.1 U3.28(VDD18) U3.30(VDD18)
3.3D: C109.1 R23.2 R24.2 R25.2 U3.20(VDD33) U3.21(VBAT) U3.32(VDDIO)
5V: R46.1 R60.1
GND: C27.2 C108.1 C109.2 C110.1 R47.2 R62.1 R64.2 U3.0(EPAD) X2.2(NC_2) X2.4(NC_4)
USB_HS_CK: U3.1(CLKOUT) ; port USB_HS_CK
USB_HS_D0: U3.3(D0)
USB_HS_D1: U3.4(D1)
USB_HS_D2: U3.5(D2)
USB_HS_D3: U3.6(D3)
USB_HS_D4: U3.7(D4)
USB_HS_D5: U3.9(D5)
USB_HS_D6: U3.10(D6)
USB_HS_D7: U3.13(D7)
USB_HS_DIR: U3.31(DIR) ; port USB_HS_DIR
USB_HS_N: U3.19(DM) USB2.2(D-)
USB_HS_NXT: U3.2(NXT) ; port USB_HS_NXT
USB_HS_P: U3.18(DP) USB2.3(D+)
USB_HS_RESET: R64.1 U3.27(RESET-) ; port USB_HS_RESET
USB_HS_STP: U3.29(STP) ; port USB_HS_STP
NetC108_2: C108.2 R61.2 U3.25(XO) X2.3 ; port CLK_24M
NetC110_2: C110.2 R61.1 U3.26(REFCLK) X2.1
NetR23_1: R23.1 U3.14(REFSEL2)
NetR24_1: R24.1 U3.11(REFSEL1)
NetR25_1: R25.1 U3.8(REFSEL0)
NetR46_2: R46.2 USB2.1(VBUS)
NetR47_1: R47.1 USB2.5(GND)
NetR60_2: R60.2 U3.22(VBUS)
NetR62_2: R62.2 U3.24(RBIAS)
NetU3_23: U3.23(ID) USB2.4(ID)

Not connected (* = marked no-connect by the designer): U3 12(NC)* 15(SPK_L)* 16(SPK_R)* 17(CPEN)*; USB2 SH(Shell)

### Buses and harness runs
bus USB_HS_D[9..0] = port USB_HS_D[9..0]

### Layout directives
differential pair: USB_HS_N, USB_HS_P

### Library data of the parts
C27 C108-C110 = CAP0402-CAP: as C68 on sheet FPGA
R23-R25 R46 R47 R60-R62 R64 = Res2: Resistor; Value: 0Ohm; Published: 8-Jun-2000; LatestRevisionDate: 17-Jul-2002; LatestRevisionNote: Re-released for DXP Platform.; PackageReference: AXIAL-0.4; Publisher: Altium Limited; PackageDescription: Axial Device, Thru-Hole; 2 Leads; 0.4 in Pin Spacing
USB2 = USB_Micro_TypeB: Connector SMD USB Micro Type B middle mount; Manufacturer 1: Molex Inc; SCDType: undef; Package / Case: SMD; Supplier 1: Digi-Key; Supplier Part Number 1: WM17142CT-ND
X2 = OSCILLATOR-3.2X2.5: Crystal Oscillator in 3.2x2.5 SMD

## Sheet power.SchDoc
size A4
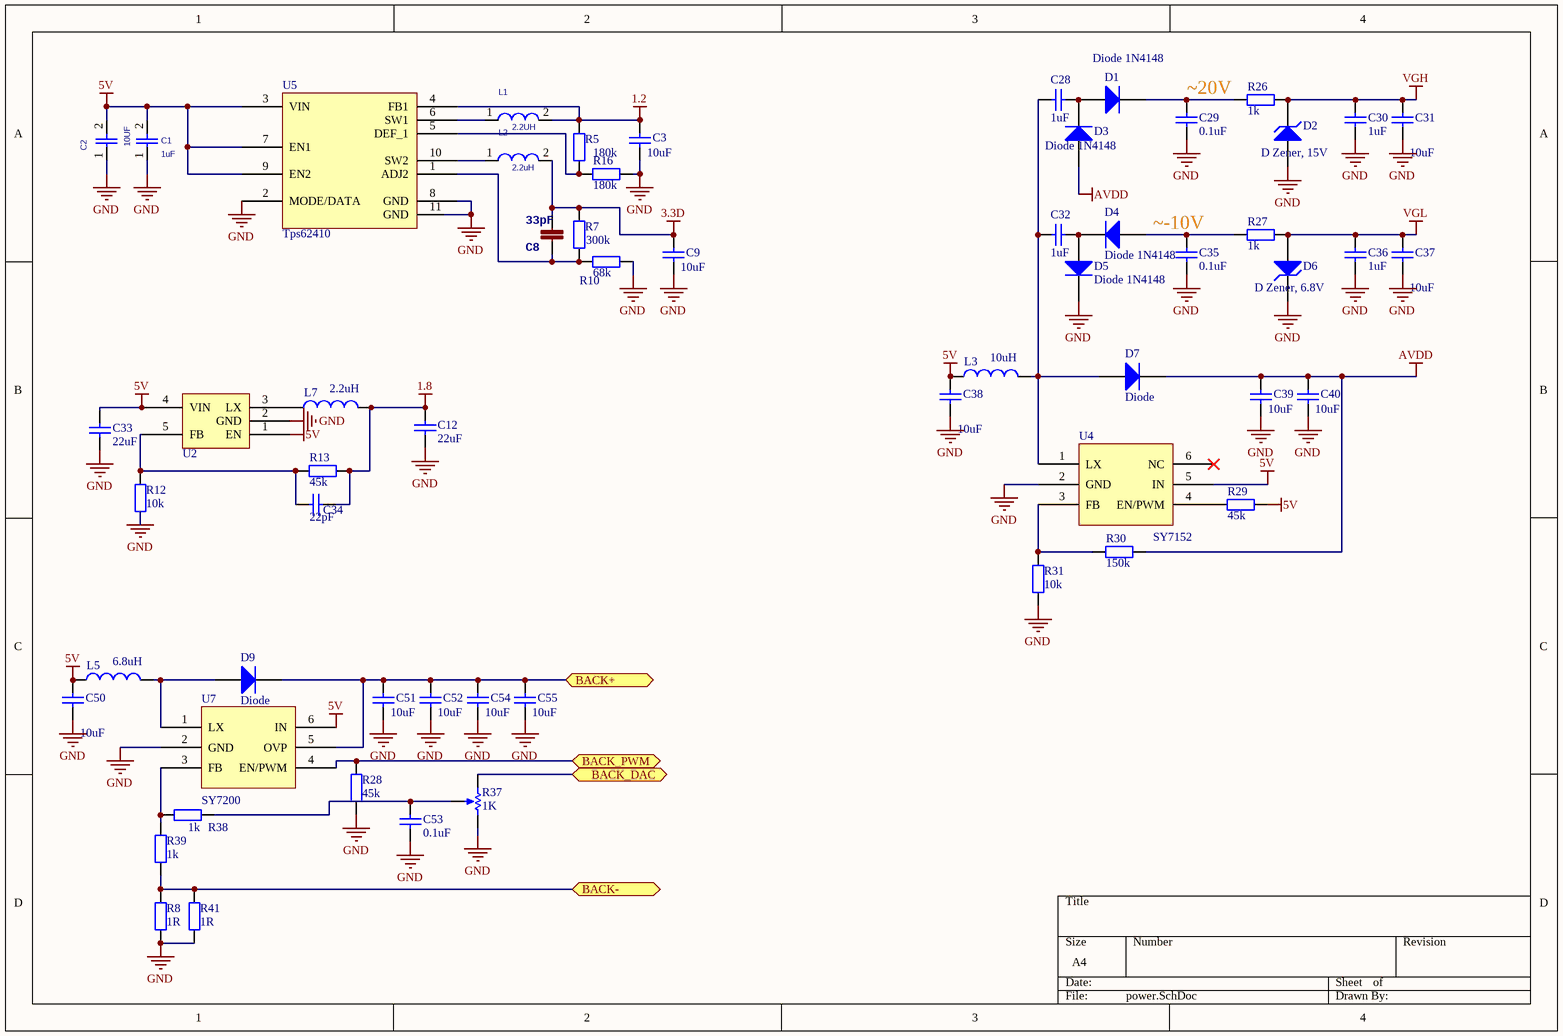
[diagram p5: power.SchDoc]

### Parts
C1  1uF  [0603]
C2  10UF  [0805]
C3  10uF  [0805]
C8  33pF  [0402]
C9  10uF  [0805]
C12  value 22uF  [0805]  (hidden comment: Cap)
C28  1uF  [0603]
C29  0.1uF  [0603]
C30  1uF  [0603]
C31  10uF  [0805]
C32  1uF  [0603]
C33  value 22uF  [0805]  (hidden comment: Cap)
C34  22pF  [0402]
C35  0.1uF  [0603]
C36  1uF  [0603]
C37  10uF  [0805]
C38  10uF  [0805]
C39  10uF  [0805]
C40  10uF  [0805]
C50  10uF  [0805]
C51  10uF  [0805]
C52  10uF  [0805]
C53  0.1uF  [0402]
C54  10uF  [0603]
C55  10uF  [0603]
D1  Diode 1N4148  [LC-SOD-323]
D2  D Zener, 15V  [LC-SOD-323]
D3  Diode 1N4148  [LC-SOD-323]
D4  Diode 1N4148  [LC-SOD-323]
D5  Diode 1N4148  [LC-SOD-323]
D6  D Zener, 6.8V  [LC-SOD-323]
D7  Diode  [LC-SOD-323]
D9  Diode  [SMA]
L1  2.2UH  [0806]
L2  2.2uH  [0806]
L3  10uH  [0806]
L5  6.8uH  [L4015]
L7  2.2uH  [0806]
R5  180k  [0402]
R7  300k  [0402]
R8  1R  [0805]
R10  68k  [0402]
R12  10k  [0402]
R13  45k  [0402]
R16  180k  [0402]
R26  1k  [0402]
R27  1k  [0402]
R28  45k  [0402]
R29  45k  [0402]
R30  150k  [0402]
R31  10k  [0402]
R37  value 1K  [POT1]  (hidden comment: RPot)
R38  1k  [0402]
R39  1k  [0402]
R41  1R  [0805]
U2  RT8059  [SOT23-5]  (value not drawn)
U4  SY7152  [SOT23-6]
U5  Tps62410  [DFN-10P-3X3]
U7  SY7200  [SOT23-6]

### Ports
BACK+, BACK-, BACK_DAC, BACK_PWM

### Nets
1.2: C3.2 L1.2 R5.1 U5.4(FB1)
1.8: C12.2 C34.1 L7.2 R13.2
3.3D: C8.1 C9.2 L2.2 R7.1
5V: C1.2 C2.2 C33.2 C38.2 C50.2 L3.1 L5.1 R29.2 U2.1(EN) U2.4(VIN) U4.5(IN) U5.3(VIN) U5.7(EN1) U5.9(EN2) U7.6(IN)
AVDD: C39.2 C40.2 D3.1(A) D7.2(K) R30.2
GND: C1.1 C2.1 C3.1 C9.1 C12.1 C29.2 C30.2 C31.1 C33.1 C35.2 C36.2 C37.1 C38.1 C39.1 C40.1 C50.1 C51.1 C52.1 C53.2 C54.1 C55.1 D2.1(A) D5.2(K) D6.2(K) R8.1 R10.2 R12.1 R16.2 R28.1 R31.1 R37.2(BOT) R41.1 U2.2(GND) U4.2(GND) U5.2(MODE/DATA) U5.8(GND) U5.11(GND) U7.2(GND)
VGH: C30.1 C31.2 D2.2(K) R26.2
VGL: C36.1 C37.2 D6.1(A) R27.2
HSWAPEN: R28.2 U7.4(EN/PWM) ; port BACK_PWM
NetC8_2: C8.2 R7.2 R10.1 U5.1(ADJ2)
NetC28_1: C28.1 D1.1(A) D3.2(K)
NetC28_2: C28.2 C32.2 D7.1(A) L3.2 U4.1(LX)
NetC29_1: C29.1 D1.2(K) R26.1
NetC32_1: C32.1 D4.2(K) D5.1(A)
NetC34_2: C34.2 R12.2 R13.1 U2.5(FB)
NetC35_1: C35.1 D4.1(A) R27.1
NetC51_2: C51.2 C52.2 C54.2 C55.2 D9.2(K) U7.5(OVP) ; port BACK+
NetC53_1: C53.1 R37.3(TAP) R38.1
NetD9_1: D9.1(A) L5.2 U7.1(LX)
NetL1_1: L1.1 U5.6(SW1)
NetL2_1: L2.1 U5.10(SW2)
NetL7_1: L7.1 U2.3(LX)
NetMCU1_20: R37.1(TOP) ; port BACK_DAC
NetP1_31: R8.2 R39.1 R41.2 ; port BACK-
NetR5_2: R5.2 R16.1 U5.5(DEF_1)
NetR29_1: R29.1 U4.4(EN/PWM)
NetR30_1: R30.1 R31.2 U4.3(FB)
NetR38_2: R38.2 R39.2 U7.3(FB)

Not connected (* = marked no-connect by the designer): U4 6(NC)*

### Notes on the sheet
- ~20V
- (near C35) ~-10V

### Library data of the parts
C1 C2 = CAP/0402: 1st Part Field: 0402
C3 C9 C12 C28-C40 C50-C55 = Cap: Capacitor; Published: 8-Jun-2000; LatestRevisionDate: 17-Jul-2002; LatestRevisionNote: Re-released for DXP Platform.; PackageReference: RAD-0.3; Publisher: Altium Limited; PackageDescription: Radial Cap, Thru-Hole; 2 Leads; 0.3 in Pin Spacing
C8 = CAP0402-CAP: as C68 on sheet FPGA
D1 D3-D5 = Diode 1N4148: High Conductance Fast Diode; Published: 8-Jun-2000; LatestRevisionDate: 17-Jul-2002; LatestRevisionNote: Re-released for DXP Platform.; DatasheetVersion: 1997; PackageReference: DO-35; Publisher: Altium Limited; PackageDescription: Diode, Axial; Body 3.8 x 1.9 mm (LxDia. max), Lead Dia. 0.53 mm (max); Code_JEDEC: DO-204-AH; ComponentLink1Description: Manufacturer Link; ComponentLink1URL: http://www.fairchildsemi.com/; ComponentLink2Description: Datasheet; ComponentLink2URL: http://www.fairchildsemi.com/ds/1N%2F1N4148.pdf
D2 D6 = D Zener: Zener Diode; Published: 8-Jun-2000; LatestRevisionDate: 17-Jul-2002; LatestRevisionNote: Re-released for DXP Platform.; PackageReference: DIODE-0.7; Publisher: Altium Limited; PackageDescription: Diode, Thru-Hole; 2 Leads; 0.7 in Pin Spacing
D7 D9 = Diode: Default Diode; Published: 8-Jun-2000; LatestRevisionDate: 17-Jul-2002; LatestRevisionNote: Re-released for DXP Platform.; PackageVersion: Sep-1996; PackageReference: SMC; Publisher: Altium Limited; PackageDescription: DO-214-AB/SMC; 2 C-Bend Leads; Body 7.9 x 5.9 mm, inc. leads (LxW); Code_JEDEC: DO-214-AB
L1 L2 = L/2.5*2.0
L3 L5 L7 = Inductor: Code_IEC: 1005; Published: 8-Jun-2000; LatestRevisionDate: 29-May-2009; LatestRevisionNote: IPC-7351 Footprint Added.; PackageReference: 0402-A; Publisher: Altium Limited; PackageDescription: Chip Inductor; Code_JEITA: 0402
R5 R7 R8 R10 R12 R13 R16 R26-R31 R38 R39 R41 = Res2: Resistor; Published: 8-Jun-2000; LatestRevisionDate: 17-Jul-2002; LatestRevisionNote: Re-released for DXP Platform.; PackageReference: AXIAL-0.4; Publisher: Altium Limited; PackageDescription: Axial Device, Thru-Hole; 2 Leads; 0.4 in Pin Spacing
R37 = RPot: as R2 on sheet LCD; Published: 8-Jun-2000; LatestRevisionDate: 17-Jul-2002; LatestRevisionNote: Re-released for DXP Platform.; PackageReference: VR5; Publisher: Altium Limited; PackageDescription: Variable Resistor, Thru-Hole; 3 Leads

## Sheet HDMI.SchDoc
size A4
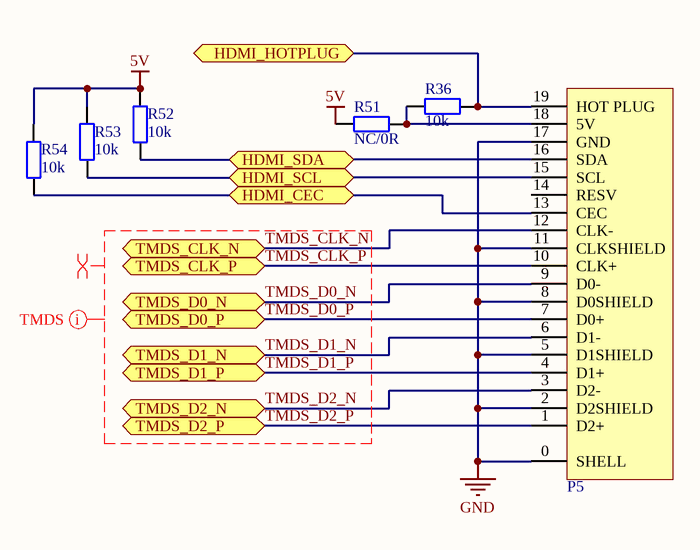
[diagram p6: HDMI.SchDoc]

### Parts
P5  HDMI  [HDMI]  (value not drawn)
R36  10k  [0402]
R51  NC/0R  [0402]
R52  10k  [0402]
R53  10k  [0402]
R54  10k  [0402]

### Ports
HDMI_CEC, HDMI_HOTPLUG, HDMI_SCL, HDMI_SDA, TMDS_CLK_N, TMDS_CLK_P, TMDS_D0_N, TMDS_D0_P, TMDS_D1_N, TMDS_D1_P, TMDS_D2_N, TMDS_D2_P

### Nets
5V: R51.1 R52.1 R53.1 R54.1
GND: P5.0(SHELL) P5.2(D2SHIELD) P5.5(D1SHIELD) P5.8(D0SHIELD) P5.11(CLKSHIELD) P5.17(GND)
TMDS_CLK_N: P5.12(CLK-) ; port TMDS_CLK_N
TMDS_CLK_P: P5.10(CLK+) ; port TMDS_CLK_P
TMDS_D0_N: P5.9(D0-) ; port TMDS_D0_N
TMDS_D0_P: P5.7(D0+) ; port TMDS_D0_P
TMDS_D1_N: P5.6(D1-) ; port TMDS_D1_N
TMDS_D1_P: P5.4(D1+) ; port TMDS_D1_P
TMDS_D2_N: P5.3(D2-) ; port TMDS_D2_N
TMDS_D2_P: P5.1(D2+) ; port TMDS_D2_P
NetP5_13: P5.13(CEC) R54.2 ; port HDMI_CEC
NetP5_15: P5.15(SCL) R53.2 ; port HDMI_SCL
NetP5_16: P5.16(SDA) R52.2 ; port HDMI_SDA
NetP5_18: P5.18(5V) R36.2 R51.2
NetP5_19: P5.19(HOT_PLUG) R36.1 ; port HDMI_HOTPLUG

Not connected (* = marked no-connect by the designer): P5 14(RESV)

### Layout directives
differential pair: TMDS_CLK_N, TMDS_CLK_P, TMDS_D0_N, TMDS_D0_P, TMDS_D1_N, TMDS_D1_P, TMDS_D2_N, TMDS_D2_P
net class TMDS: TMDS_CLK_N, TMDS_CLK_P, TMDS_D0_N, TMDS_D0_P, TMDS_D1_N, TMDS_D1_P, TMDS_D2_N, TMDS_D2_P

### Library data of the parts
R36 R51-R54 = Res2: Resistor; Value: 0Ohm; Published: 8-Jun-2000; LatestRevisionDate: 17-Jul-2002; LatestRevisionNote: Re-released for DXP Platform.; PackageReference: AXIAL-0.4; Publisher: Altium Limited; PackageDescription: Axial Device, Thru-Hole; 2 Leads; 0.4 in Pin Spacing

## Nets that join several sheets
1.2: FPGA (10 pins), camera (R32.2), power (C3.2 L1.2 R5.1 U5.4)
1.8: USB_HS_PHY (C27.1 U3.28 U3.30), power (C12.2 C34.1 L7.2 R13.2)
3.3D: FPGA (46 pins), mcu (14 pins), camera (C44.2 R34.1 U6.1 U6.3), LCD (7 pins), USB_HS_PHY (7 pins), power (C8.1 C9.2 L2.2 R7.1)
5V: mcu (P2.1), USB_HS_PHY (R46.1 R60.1), power (15 pins), HDMI (R51.1 R52.1 R53.1 R54.1)
AVDD: LCD (P1.29), power (5 pins)
GND: FPGA (49 pins), mcu (12 pins), camera (9 pins), LCD (17 pins), USB_HS_PHY (10 pins), power (38 pins), HDMI (6 pins)
VGH: LCD (P1.38), power (C30.1 C31.2 D2.2 R26.2)
VGL: LCD (P1.35), power (C36.1 C37.2 D6.1 R27.2)
CCLK: FPGA (U1.R11 U8.6), mcu (MCU1.55)
CK_N: FPGA (U1.A9), LCD (C48.1 P1.17)
CK_P: FPGA (U1.C9), LCD (C48.2 P1.18)
D0_N: FPGA (U1.A12), LCD (C45.1 P1.8)
D0_P: FPGA (U1.B12), LCD (C45.2 P1.9)
D1_N: FPGA (U1.A11), LCD (C46.1 P1.11)
D1_P: FPGA (U1.C11), LCD (C46.2 P1.12)
D2_N: FPGA (U1.A10), LCD (C47.1 P1.14)
D2_P: FPGA (U1.B10), LCD (C47.2 P1.15)
D3_N: FPGA (U1.A6), LCD (C49.1 P1.20)
D3_P: FPGA (U1.B6), LCD (C49.2 P1.21)
DATA: FPGA (U1.P10 U8.2), mcu (MCU1.23)
FPGA_CLK: FPGA (U1.C10), mcu (MCU1.58)
FPGA_CLK2: FPGA (U1.E10), mcu (MCU1.59)
FPGA_MCLK: FPGA (U1.T8), mcu (MCU1.40)
HSWAPEN: FPGA (R45#1.1), mcu (MCU1.61), power (R28.2 U7.4)
INIT_B: FPGA (U1.R3), mcu (MCU1.56)
NetC51_2: LCD (P1.39 P1.40), power (6 pins)
NetC108_2: mcu (MCU1.5), USB_HS_PHY (C108.2 R61.2 U3.25 X2.3)
NetMCU1_2: FPGA (U1.E16), mcu (MCU1.2)
NetMCU1_20: mcu (MCU1.20), power (R37.1)
NetMCU1_41: mcu (MCU1.41), LCD (P1.28 R14.1 R15.2)
NetMCU1_42: mcu (MCU1.42), LCD (P1.33 R17.2)
NetMCU1_43: mcu (MCU1.43), LCD (P1.34 R18.2)
NetMCU1_44: mcu (MCU1.44), LCD (P1.5 R9.2)
NetP1_31: LCD (P1.31 P1.32), power (R8.2 R39.1 R41.2)
PC10: FPGA (U1.G14), mcu (MCU1.51)
PC11: FPGA (U1.F16), mcu (MCU1.52)
PC12: FPGA (U1.F15), mcu (MCU1.53)
PROGRAM: FPGA (R44.2 U1.T2), mcu (MCU1.62)
TMDS_CLK_N: FPGA (U1.T7), HDMI (P5.12)
TMDS_CLK_P: FPGA (U1.R7), HDMI (P5.10)
TMDS_D0_N: FPGA (U1.M7), HDMI (P5.9)
TMDS_D0_P: FPGA (U1.P7), HDMI (P5.7)
TMDS_D1_N: FPGA (U1.N8), HDMI (P5.6)
TMDS_D1_P: FPGA (U1.M9), HDMI (P5.4)
TMDS_D2_N: FPGA (U1.T9), HDMI (P5.3)
TMDS_D2_P: FPGA (U1.R9), HDMI (P5.1)
USB_HS_CK: mcu (MCU1.21), USB_HS_PHY (U3.1)
USB_HS_DIR: mcu (MCU1.10), USB_HS_PHY (U3.31)
USB_HS_NXT: mcu (MCU1.11), USB_HS_PHY (U3.2)
USB_HS_RESET: mcu (MCU1.15), USB_HS_PHY (R64.1 U3.27)
USB_HS_STP: mcu (MCU1.8), USB_HS_PHY (U3.29)